# EAGLE design mk5-retainer (EAGLE 5.08)
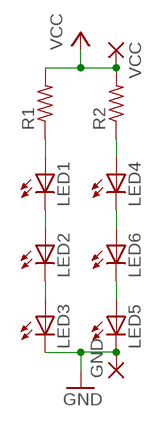
[diagram p0: schematic, sheet 1]

## Parts
GND  SMD2  [SMD1,27-2,54]
LED1  LED5MM  [LED5MM]
LED2  LED5MM  [LED5MM]
LED3  LED5MM  [LED5MM]
LED4  LED5MM  [LED5MM]
LED5  LED5MM  [LED5MM]
LED6  LED5MM  [LED5MM]
R1  R-US_0207/7  [0207/7]
R2  R-US_0207/7  [0207/7]
VCC  SMD2  [SMD1,27-2,54]

## Nets
GND: GND.1(P) LED3.K(C) LED5.K(C)
N$1: LED4.A R2.1
N$2: LED1.A R1.1
N$3: LED1.K(C) LED2.A
N$4: LED2.K(C) LED3.A
N$5: LED4.K(C) LED6.A
N$6: LED5.A LED6.K(C)
VCC: R1.2 R2.2 VCC.1(P)

## Library data of the parts
GND VCC = wirepad:SMD2: SMD PAD
LED1-LED6 = led:LED: LED OSRAM: - CHIPLED LG R971, LG N971, LY N971, LG Q971, LY Q971, LO R971, LY R971 LH N974, LH R974 LS Q976, LO Q976, LY Q976 LO Q996 - Hyper CHIPLED LW Q18S LB Q993, LB Q99A, LB R99A - SideLED LS A670, LO A670, LY A670, LG A670, LP A670 LB A673, LV A673, LT A673, LW A673 LH A674 LY A675 LS A676, LA A676, LO A676, LY A676, LW A676 LS A679, LY A679, LG A679 - Hyper Micro SIDELED® LS Y876, LA Y876, LO Y876, LY Y876 LT Y87S - SmartLED LW L88C, LW L88S LB L89C, LB L89S, LG L890 LS L89K, LO L89K, LY L89K LS L896, LA L896, LO L896, LY L896 - TOPLED LS T670, LO T670, LY T670, LG T670, LP T670 LSG T670, LSP T670, LSY T670, LOP T670, LYG T670 LG T671, LOG T671, LSG T671 LB T673, LV T673, LT T673, LW T673 LH T674 LS T676, LA T676, LO T676, LY T676, LB T676, LH T676, LSB T676, LW T676 LB T67C, LV T67C, LT T67C, LS T67K, LO T67K, LY T67K, LW E67C LS E67B, LA E67B, LO E67B, LY E67B, LB E67C, LV E67C, LT E67C LW T67C LS T679, LY T679, LG T679 LS T770, LO T770, LY T770, LG T770, LP T770 LB T773, LV T773, LT T773, LW T773 LH T774 LS E675, LA E675, LY E675, LS T675 LS T776, LA T776, LO T776, LY T776, LB T776 LHGB T686 LT T68C, LB T68C - Hyper Mini TOPLED® LB M676 - Mini TOPLED Santana® LG M470 LS M47K, LO M47K, LY M47K Source: http://www.osram.convergy.de LUXEON: - LUMILED® LXK2-PW12-R00, LXK2-PW12-S00, LXK2-PW14-U00, LXK2-PW14-V00 LXK2-PM12-R00, LXK2-PM12-S00, LXK2-PM14-U00 LXK2-PE12-Q00, LXK2-PE12-R00, LXK2-PE12-S00, LXK2-PE14-T00, LXK2-PE14-U00 LXK2-PB12-K00, LXK2-PB12-L00, LXK2-PB12-M00, LXK2-PB14-N00, LXK2-PB14-P00, LXK2-PB14-Q00 LXK2-PR12-L00, LXK2-PR12-M00, LXK2-PR14-Q00, LXK2-PR14-R00 LXK2-PD12-Q00, LXK2-PD12-R00, LXK2-PD12-S00 LXK2-PH12-R00, LXK2-PH12-S00 LXK2-PL12-P00, LXK2-PL12-Q00, LXK2-PL12-R00 Source: www.luxeon.com KINGBRIGHT: KA-3528ASYC Source: www.kingbright.com
R1 R2 = resistor:R-US_: RESISTOR, American symbol

## Board
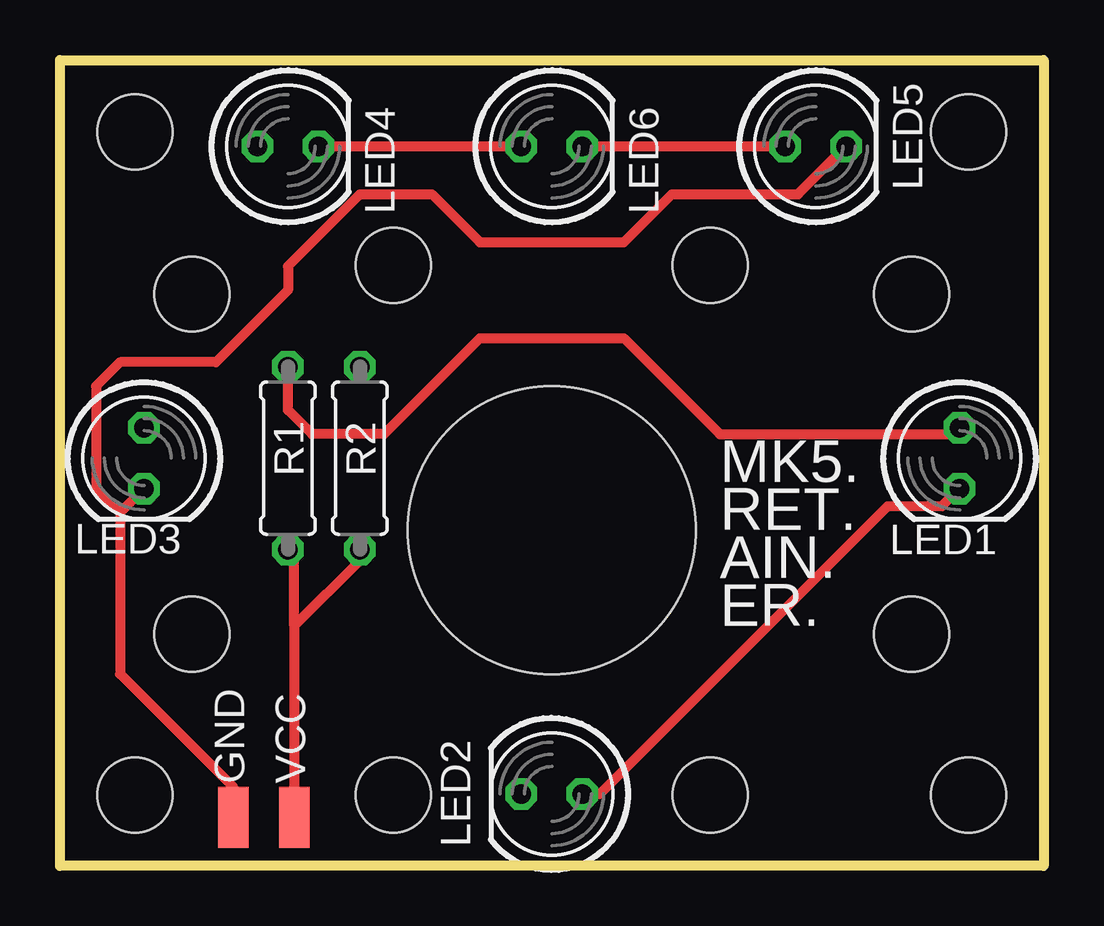
[diagram p1: board, top side]
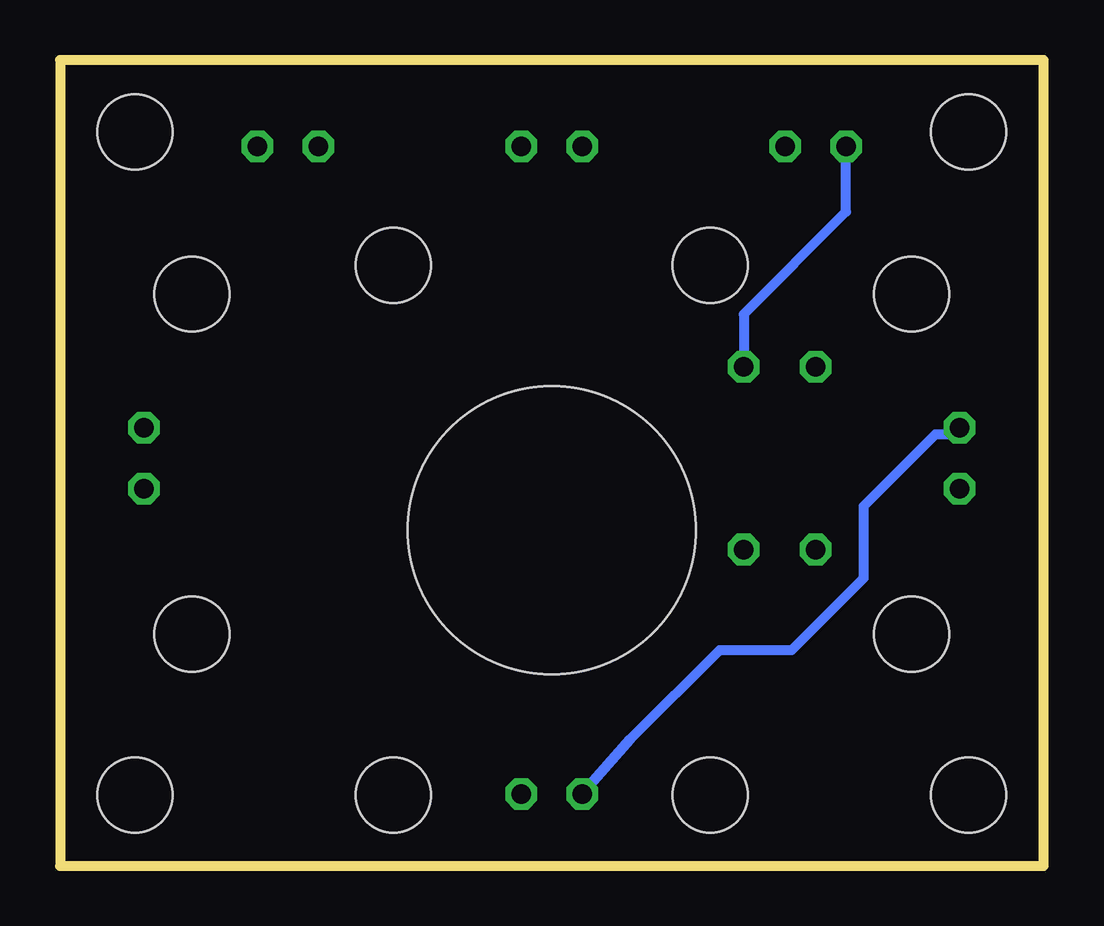
[diagram p2: board, bottom side, seen from below]

Size 41 x 33.6 mm. Coordinates in mm from the lower left corner, seen from the top.
Outline: 0,33.6 41,33.6 41,0 0,0 0,33.6
Copper layers (1*16): Top 0.035mm / dielectric 1.5mm / Bottom 0.035mm
Design rules "default": minimum track width 10mil, minimum drill 24mil, track to track 8mil, track to pad 8mil, pad to pad 8mil, via to via 8mil, smd to smd 8mil, copper to edge 40mil, drill to drill 8mil, minimum pad ring 10mil, minimum via ring 8mil, stop-mask expansion 4mil, vias tented up to drill 0mil, thermal gap 10mil
Holes 12 mm at 20.5,14
Holes 3.12 mm at 27.11,25.04 13.89,25.04 3.13,2.96 37.87,2.96 3.13,30.6 37.87,30.6 27.11,2.96 13.89,2.96 5.5,9.66 35.5,9.66 35.5,23.84 5.5,23.84

### Footprints (pad centres in the part's own frame; a part is rotated, then mirrored left to right if it is on the bottom)
SMD1,27-2,54 = smd 1.27 x 2.54: 1 0,0
LED5MM = drill 0.813 octagon: A -1.27,0; K 1.27,0
0207/7 = drill 0.813 octagon: 1 -3.81,0; 2 3.81,0

### Placement (x,y rotation side)
GND  7.23,2.03 0 top
LED1  37.5,17 270 top
LED2  20.5,3 180 top
LED3  3.5,17 270 top
LED4  9.5,30 0 top
LED5  31.5,30 0 top
LED6  20.5,30 0 top
R1  9.5,17 270 top
R2  12.5,17 270 top
VCC  9.77,2.03 0 top

### Tracks (layer width: path | path; a pad name or v marks a point on that pad's centre or on a via)
GND
  Top 0.406: LED5.K 30.77,28 25.5,28 23.5,26 17.5,26 15.5,28 12.5,28 9.5,25 9.5,24 6.5,21 2.5,21 1.5,20 1.5,15.73 2.5,14.73 | GND.1 7.23,3.27 2.5,8 2.5,14.73 | 2.5,14.73 LED3.K
N$1
  Bottom 0.406: LED4.A 8.23,27.27 12.5,23 R2.1
N$2
  Top 0.406: R1.1 9.5,19 10.5,18 13.5,18 17.5,22 23.5,22 27.5,18 37.23,18 LED1.A
N$3
  Top 0.406: LED2.A 22.5,3 34.5,15 36.77,15 LED1.K
N$4
  Bottom 0.406: LED2.K 17.23,5.27 13.5,9 10.5,9 7.5,12 7.5,15 4.5,18 3.77,18 LED3.A
N$5
  Top 0.406: LED4.K LED6.A
N$6
  Top 0.406: LED6.K LED5.A
VCC
  Top 0.406: 9.77,10 9.77,12.92 R1.2 | 9.77,10 VCC.1 | R2.2 12.5,12.73 9.77,10

### Text on the board
tPlace: MK5. | RET. | AIN. | ER.